# EAGLE schematic CrowPanel ESP32 Display-7.0-inch-V3.0-20240420 (EAGLE 9.6.2)
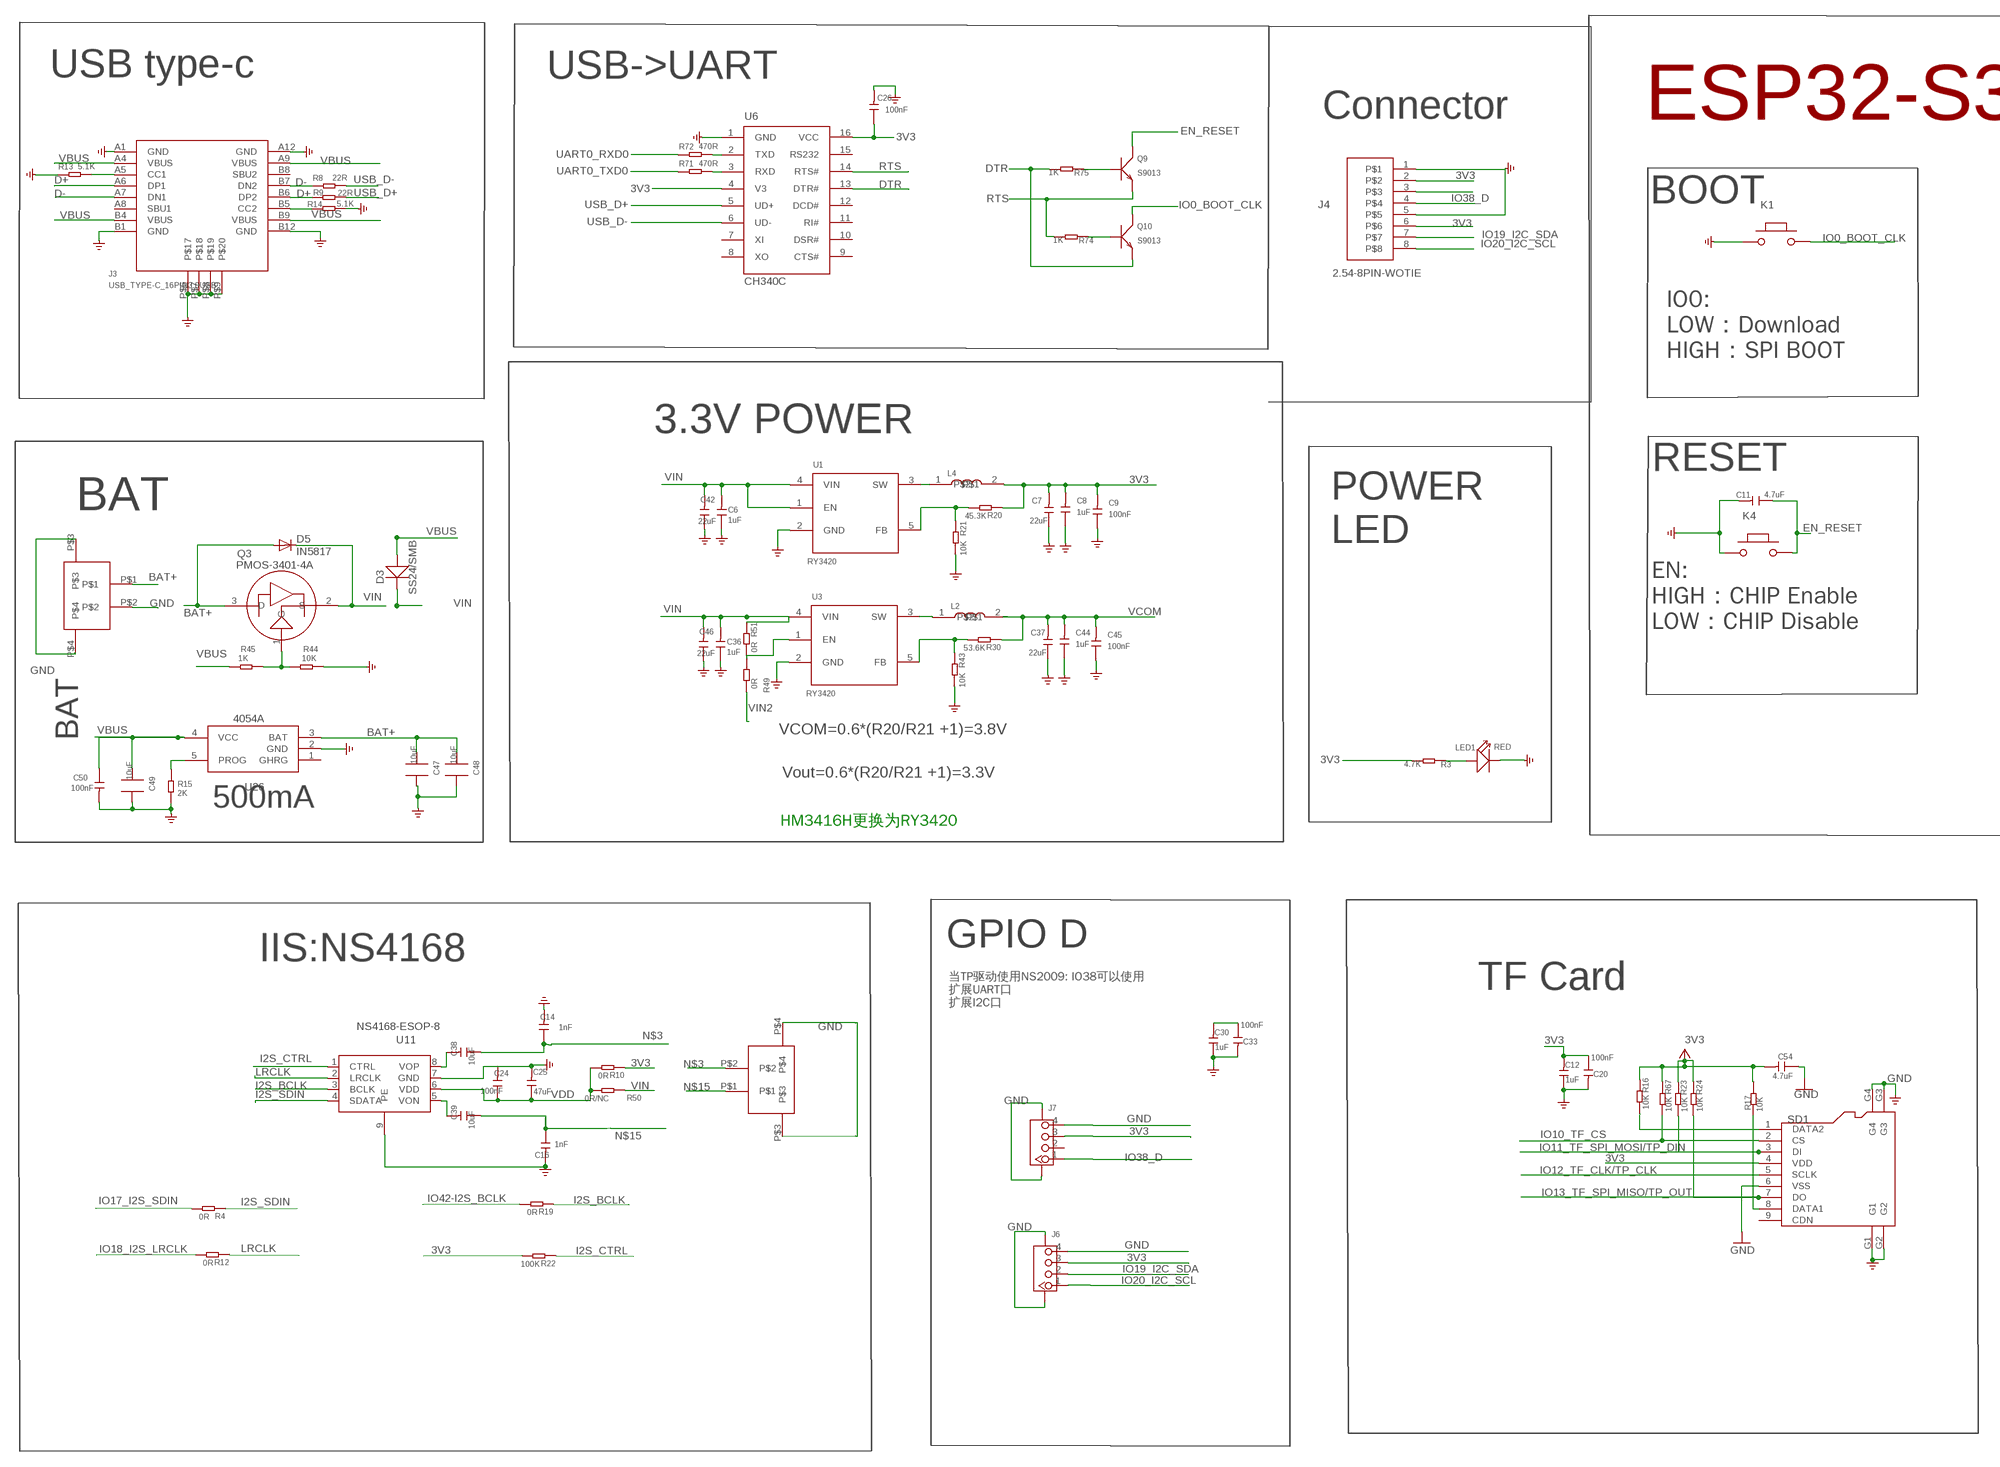
[diagram p0: schematic, sheet 1, part 1 of 2]
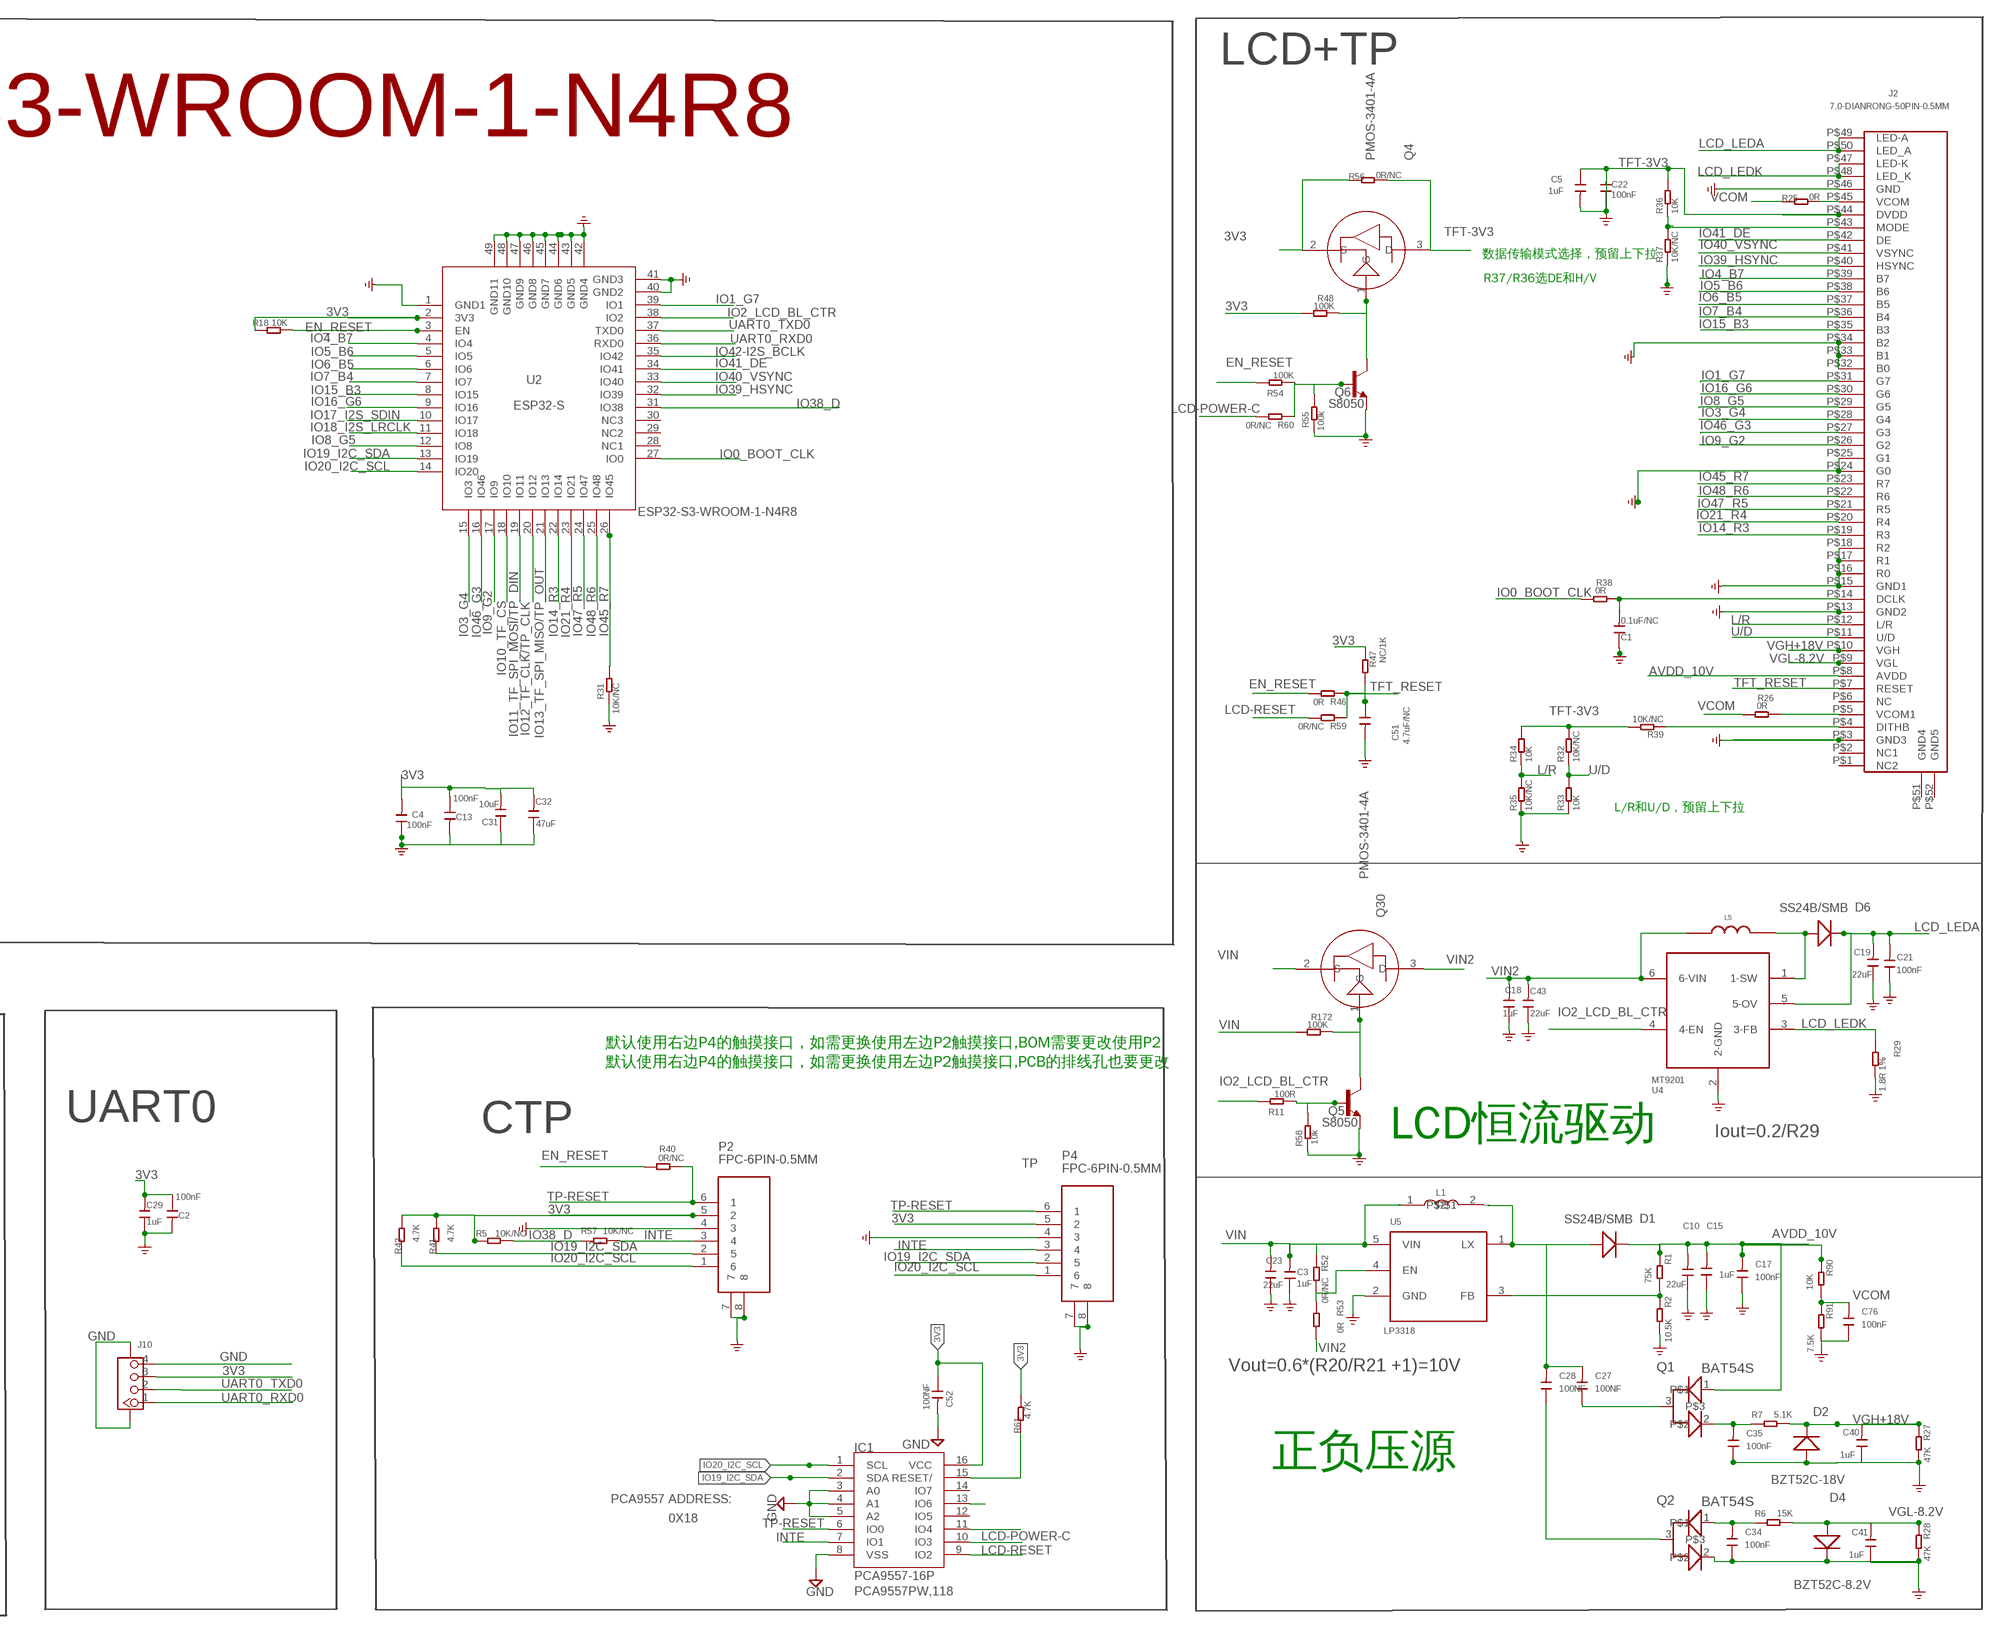
[diagram p1: schematic, sheet 1, part 2 of 2]

## Parts
C1  0.1uF/NC  DISCRETE_C-0603  [DISCRETE_C0603]
C2  100nF  C-0603  [C0603]
C3  1uF  C0603  [0603]
C4  100nF  C-0603  [C0603]
C5  1uF  C-0603  [C0603]
C6  1uF  C0603  [0603]
C7  22uF  C0805  [0805]
C8  1uF  C0603  [0603]
C9  100nF  C0603  [0603]
C10  22uF  C0805  [0805]
C11  4.7uF  C0603  [0603]
C12  1uF  DISCRETE_C-0603  [DISCRETE_C0603]
C13  100nF  C-0603  [C0603]
C14  1nF  C-0603  [C0603]
C15  1uF  C0603  [0603]
C16  1nF  C-0603  [C0603]
C17  100nF  C0603  [0603]
C18  1uF  C0603  [0603]
C19  22uF  C0805  [0805]
C20  100nF  C-0603  [C0603]
C21  100nF  C0603  [0603]
C22  100nF  C-0603  [C0603]
C23  22uF  C0805  [0805]
C24  100nF  C-0603  [C0603]
C25  47uF  C0805  [0805]
C26  100nF  C0603  [0603]
C27  100NF  C0603  [0603]
C28  100NF  C0603  [0603]
C29  1uF  DISCRETE_C-0603  [DISCRETE_C0603]
C30  1uF  DISCRETE_C-0603  [DISCRETE_C0603]
C31  10uF  DISCRETE_C-0603  [DISCRETE_C0603]
C32  47uF  C0805  [0805]
C33  100nF  C-0603  [C0603]
C34  100nF  C0603  [0603]
C35  100nF  C0603  [0603]
C36  1uF  C0603  [0603]
C37  22uF  C0805  [0805]
C38  10uF  C-0603  [C0603]
C39  10uF  C-0603  [C0603]
C40  1uF  C0805  [0805]
C41  1uF  C0805  [0805]
C42  22uF  C0805  [0805]
C43  22uF  C0805  [0805]
C44  1uF  C0603  [0603]
C45  100nF  C0603  [0603]
C46  22uF  C0805  [0805]
C47  10uF  C0805_S  [0805_S]
C48  10uF  C0805_S  [0805_S]
C49  10uF  C0805_S  [0805_S]
C50  100nF  C-0603  [C0603]
C51  4.7uF/NC  C0603  [0603]
C52  100NF  A_XBJ_C0603  [A_XBJ_0603]
C54  4.7uF  DISCRETE_C-0603  [DISCRETE_C0603]
C76  100nF  C0603  [0603]
D1  SS24B/SMB  214ABDO-214AB  [214AB]
D2  BZT52C-18V  DISCRETE_D1206  [DISCRETE_SOD123]
D3  SS24/SMB  214ABDO-214AB  [214AB]
D4  BZT52C-8.2V  DISCRETE_D1206  [DISCRETE_SOD123]
D5  IN5817  DIODE-DO-214AC  [DO-214AC]
D6  SS24B/SMB  214ABDO-214AB  [214AB]
IC1  PCA9557-16P  [TSSOP16]
J1  PH2.0WT-2PIN  [PH2.0WT-2PIN]
J2  7.0-DIANRONG-50PIN-0.5MM  [7.0-DAINRONG-50PIN-0.5MM]
J3  USB_TYPE-C_16PIN3.0USB  [KEVIN_3.0TYPEC-SMD]
J4  2.54-8PIN-WOTIE  [2.54-8P-WOTIE]
J5  PH2.0WT-2PIN  [PH2.0WT-2PIN]
J6  CONNECTOR_TWIG-4P-2.0-SMD-FEMALE-REINFORCE90D  [CONNECTOR_4P-SMD-2.0-90D]
J7  CONNECTOR_TWIG-4P-2.0-SMD-FEMALE-REINFORCE90D  [CONNECTOR_4P-SMD-2.0-90D]
J10  CONNECTOR_TWIG-4P-2.0-SMD-FEMALE-REINFORCE90D  [CONNECTOR_4P-SMD-2.0-90D]
K1  BUTTON  PB157  [157SW]
K4  BUTTON  PB157  [157SW]
L1  L-0530  [CD54_CD54]
L2  L-0530  [CD54_CD54]
L4  L-0530  [CD54_CD54]
L5  CD32_6.8uH  CD32_950MA  [CD32]
LED1  RED  DISCRETE_LED0603  [DISCRETE_LED-0603]
P2  FPC-6PIN-0.5MM  [FPC-6PIN-0.5MM]
P4  FPC-6PIN-0.5MM  [FPC-6PIN-0.5MM]
Q1  BAT54S  [SOT23-3]
Q2  BAT54S  [SOT23-3]
Q3  PMOS-3401-4A  P-MOS-SOT23  [SOT-23]
Q4  PMOS-3401-4A  P-MOS-SOT23  [SOT-23]
Q5  S8050  SPARKFUN_TRANSISTOR_NPNSOT23  [SPARKFUN_SOT23]
Q6  S8050  SPARKFUN_TRANSISTOR_NPNSOT23  [SPARKFUN_SOT23]
Q9  S9013  TRANSISTOR-NPN-SOT23  [SOT23@1]
Q10  S9013  TRANSISTOR-NPN-SOT23  [SOT23@1]
Q30  PMOS-3401-4A  P-MOS-SOT23  [SOT-23]
R1  75K  DISCRETE_R-0603  [DISCRETE_R0603]
R2  10.5K  DISCRETE_R-0603  [DISCRETE_R0603]
R3  4.7K  DISCRETE_R-0603  [DISCRETE_R0603]
R4  0R  DISCRETE_R-0603  [DISCRETE_R0603]
R5  10K/NC  DISCRETE_R-0603  [DISCRETE_R0603]
R6  15K  DISCRETE_R-0603  [DISCRETE_R0603]
R7  5.1K  DISCRETE_R-0603  [DISCRETE_R0603]
R8  22R  DISCRETE_R-0603  [DISCRETE_R0603]
R9  22R  DISCRETE_R-0603  [DISCRETE_R0603]
R10  0R  DISCRETE_R-0603  [DISCRETE_R0603]
R11  100R  R0603  [R0603]
R12  0R  DISCRETE_R-0603  [DISCRETE_R0603]
R13  5.1K  DISCRETE_R-0603  [DISCRETE_R0603]
R14  5.1K  DISCRETE_R-0603  [DISCRETE_R0603]
R15  2K  DISCRETE_R-0603  [DISCRETE_R0603]
R16  10K  DISCRETE_R-0603  [DISCRETE_R0603]
R17  10K  DISCRETE_R-0603  [DISCRETE_R0603]
R18  10K  DISCRETE_R-0603  [DISCRETE_R0603]
R19  0R  DISCRETE_R-0603  [DISCRETE_R0603]
R20  45.3K  DISCRETE_R-0603  [DISCRETE_R0603]
R21  10K  DISCRETE_R-0603  [DISCRETE_R0603]
R22  100K  DISCRETE_R-0603  [DISCRETE_R0603]
R23  10K  DISCRETE_R-0603  [DISCRETE_R0603]
R24  10K  DISCRETE_R-0603  [DISCRETE_R0603]
R25  0R  DISCRETE_R-0603  [DISCRETE_R0603]
R26  0R  R-0603  [R0603]
R27  47K  DISCRETE_R-0603  [DISCRETE_R0603]
R28  47K  DISCRETE_R-0603  [DISCRETE_R0603]
R29  1.8R 1%  DISCRETE_R-0603  [DISCRETE_R0603]
R30  53.6K  DISCRETE_R-0603  [DISCRETE_R0603]
R31  10K/NC  R0603  [R0603]
R32  10K/NC  DISCRETE_R-0603  [DISCRETE_R0603]
R33  10K  DISCRETE_R-0603  [DISCRETE_R0603]
R34  10K  DISCRETE_R-0603  [DISCRETE_R0603]
R35  10K/NC  DISCRETE_R-0603  [DISCRETE_R0603]
R36  10K  DISCRETE_R-0603  [DISCRETE_R0603]
R37  10K/NC  DISCRETE_R-0603  [DISCRETE_R0603]
R38  0R  R-0603  [R0603]
R39  10K/NC  DISCRETE_R-0603  [DISCRETE_R0603]
R40  0R/NC  R-0603  [R0603]
R41  4.7K  DISCRETE_R-0603  [DISCRETE_R0603]
R42  4.7K  DISCRETE_R-0603  [DISCRETE_R0603]
R43  10K  DISCRETE_R-0603  [DISCRETE_R0603]
R44  10K  DISCRETE_R-0603  [DISCRETE_R0603]
R45  1K  DISCRETE_R-0603  [DISCRETE_R0603]
R46  0R  DISCRETE_R-0603  [DISCRETE_R0603]
R47  NC/1K  DISCRETE_R-0603  [DISCRETE_R0603]
R48  100K  R-0603  [R0603]
R49  0R  DISCRETE_R-0603  [DISCRETE_R0603]
R50  0R/NC  DISCRETE_R-0603  [DISCRETE_R0603]
R51  0R  DISCRETE_R-0603  [DISCRETE_R0603]
R52  0R/NC  DISCRETE_R-0603  [DISCRETE_R0603]
R53  0R  DISCRETE_R-0603  [DISCRETE_R0603]
R54  100K  R0603  [R0603]
R55  100k  R0603  [R0603]
R56  0R/NC  DISCRETE_R-0603  [DISCRETE_R0603]
R57  10K/NC  DISCRETE_R-0603  [DISCRETE_R0603]
R58  10k  R0603  [R0603]
R59  0R/NC  DISCRETE_R-0603  [DISCRETE_R0603]
R60  0R/NC  DISCRETE_R-0603  [DISCRETE_R0603]
R61  4.7K  DISCRETE_R-0603  [DISCRETE_R0603]
R67  10K  DISCRETE_R-0603  [DISCRETE_R0603]
R71  470R  DISCRETE_R-0603  [DISCRETE_R0603]
R72  470R  DISCRETE_R-0603  [DISCRETE_R0603]
R74  1K  DISCRETE_R-0603  [DISCRETE_R0603]
R75  1K  DISCRETE_R-0603  [DISCRETE_R0603]
R90  10K  DISCRETE_R-0603  [DISCRETE_R0603]
R91  7.5K  DISCRETE_R-0603  [DISCRETE_R0603]
R172  100K  R-0603  [R0603]
SD1  HOLDER-MICROSD-9P  [9P-SMD-W/-RING]
U1  RY3420  A_XBJ_HM3420B  [A_XBJ_SOT23-5]
U2  ESP32-S  [ESP32-S3]
U3  RY3420  A_XBJ_HM3420B  [A_XBJ_SOT23-5]
U4  MT9201  [SOT23-6]
U5  LP3318  [LP3318_SOT23-5]
U6  CH340C  CH340G  [SOP-16]
U11  NS4168-ESOP-8  [NS4168-ESOP-8]
U26  4054A  [SOP23-5]

## Nets
3V3: C2.1 C4.2 C7.2 C8.2 C9.2 C12.2 C13.1 C20.1 C26.1 C29.2 C30.2 C31.2 C32.2 C33.1 C52.1 C54.2 IC1.16(VCC) J4.2 J4.6 J6.3 J7.3 J10.3 L4.2 P2.5 P4.5 Q4.2(S) R3.2 R5.1 R10.1 R16.1 R17.1 R18.1 R20.1 R22.2 R23.1 R24.1 R41.2 R42.2 R47.2 R48.1 R56.1 R61.2 R67.1 SD1.4(VDD) U2.2(3V3) U6.4(V3) U6.16(VCC) ; supply symbol labelled +3V3
AVDD_10V: C10.2 C15.2 C17.2 D1.2(-) J2.P$8(AVDD) Q1.1 R1.1 R90.1
BAT+: C47.2 C48.2 D5.A J1.P$1 Q3.3(D) U26.3(BAT)
D+: J3.A6(DP1) J3.B6(DP2) R9.1
D-: J3.A7(DN1) J3.B7(DN2) R8.1
DCLK1: C1.2 J2.P$14(DCLK) R38.2
DTR: Q10.2(E) R75.2 U6.13(DTR#)
EN_RESET: C11.1 K4.2 Q9.3(C) R18.2 R40.1 R46.2 R54.2 U2.3(EN)
GND: C1.1 C2.2 C3.1 C4.1 C5.2 C6.1 C7.1 C8.1 C9.1 C10.1 C11.2 C12.1 C13.2 C14.2 C15.1 C16.2 C17.1 C18.1 C19.1 C20.2 C21.1 C22.1 C23.1 C24.2 C25.2 C26.2 C29.1 C30.1 C31.1 C32.1 C33.2 C34.1 C35.1 C36.1 C37.1 C40.1 C41.1 C42.1 C43.1 C44.1 C45.1 C46.1 C47.1 C48.1 C49.1 C50.2 C51.2 C52.2 C54.1 C76.1 D2.+ D4.- IC1.3(A0) IC1.4(A1) IC1.5(A2) IC1.8(VSS) J1.P$2 J1.P$3 J1.P$4 J2.P$3(GND3) J2.P$13(GND2) J2.P$15(GND1) J2.P$16(R0) J2.P$17(R1) J2.P$18(R2) J2.P$24(G0) J2.P$25(G1) J2.P$32(B0) J2.P$33(B1) J2.P$34(B2) J2.P$46(GND) J3.A1(GND) J3.A12(GND) J3.B1(GND) J3.B12(GND) J3.P$6 J3.P$7 J3.P$8 J3.P$9 J4.1 J4.5 J5.P$3 J5.P$4 J6.4 J6.SS1 J6.SS2 J7.4 J7.SS1 J7.SS2 J10.4 J10.SS1 J10.SS2 K1.1 K4.1 LED1.- P2.4 P2.7 P2.8 P4.4 P4.7 P4.8 Q2.2 Q5.2(E) Q6.2(E) R2.2 R13.1 R14.2 R15.2 R21.2 R27.2 R28.2 R29.2 R31.1 R33.1 R35.1 R37.1 R43.2 R44.1 R55.1 R58.1 R91.2 SD1.6(VSS) SD1.G1 SD1.G2 SD1.G3 SD1.G4 U1.2(GND) U2.1(GND1) U2.40(GND2) U2.41(GND3) U2.42(GND4) U2.43(GND5) U2.44(GND6) U2.45(GND7) U2.46(GND8) U2.47(GND9) U2.48(GND10) U2.49(GND11) U3.2(GND) U4.2(2-GND) U5.2(GND) U6.1(GND) U11.7(GND) U11.9(PE) U26.2(GND)
I2S_BCLK: R19.1 U11.3(BCLK)
I2S_CTRL: R22.1 U11.1(CTRL)
I2S_SDIN: R4.1 U11.4(SDATA)
INTE: IC1.7(IO1) P2.3 P4.3 R57.2
IO0_BOOT_CLK: K1.2 Q10.3(C) R38.1 U2.27(IO0)
IO1_G7: J2.P$31(G7) U2.39(IO1)
IO2_LCD_BL_CTR: R11.2 U2.38(IO2) U4.4(4-EN)
IO3_G4: J2.P$28(G4) U2.15(IO3)
IO4_B7: J2.P$39(B7) U2.4(IO4)
IO5_B6: J2.P$38(B6) U2.5(IO5)
IO6_B5: J2.P$37(B5) U2.6(IO6)
IO7_B4: J2.P$36(B4) U2.7(IO7)
IO8_G5: J2.P$29(G5) U2.12(IO8)
IO9_G2: J2.P$26(G2) U2.17(IO9)
IO10_TF_CS: R67.2 SD1.2(CS) U2.18(IO10)
IO11_TF_SPI_MOSI/TP_DIN: R23.2 SD1.3(DI) U2.19(IO11)
IO12_TF_CLK/TP_CLK: SD1.5(SCLK) U2.20(IO12)
IO13_TF_SPI_MISO/TP_OUT: R24.2 SD1.7(DO) U2.21(IO13)
IO14_R3: J2.P$19(R3) U2.22(IO14)
IO15_B3: J2.P$35(B3) U2.8(IO15)
IO16_G6: J2.P$30(G6) U2.9(IO16)
IO17_I2S_SDIN: R4.2 U2.10(IO17)
IO18_I2S_LRCLK: R12.2 U2.11(IO18)
IO19_I2C_SDA: IC1.2(SDA) J4.7 J6.2 P2.2 P4.2 R41.1 U2.13(IO19)
IO20_I2C_SCL: IC1.1(SCL) J4.8 J6.1 P2.1 P4.1 R42.1 U2.14(IO20)
IO21_R4: J2.P$20(R4) U2.23(IO21)
IO38_D: J4.4 J7.1 R5.2 R57.1 U2.31(IO38)
IO39_HSYNC: J2.P$40(HSYNC) U2.32(IO39)
IO40_VSYNC: J2.P$41(VSYNC) U2.33(IO40)
IO41_DE: J2.P$42(DE) U2.34(IO41)
IO42-I2S_BCLK: R19.2 U2.35(IO42)
IO45_R7: J2.P$23(R7) R31.2 U2.26(IO45)
IO46_G3: J2.P$27(G3) U2.16(IO46)
IO47_R5: J2.P$21(R5) U2.24(IO47)
IO48_R6: J2.P$22(R6) U2.25(IO48)
L/R: J2.P$12(L/R) R34.1 R35.2
LCD-POWER-C: IC1.10(IO3) R60.2
LCD-RESET: IC1.9(IO2) R59.2
LCD_LEDA: C19.2 C21.2 D6.2(-) J2.P$49(LED-A) J2.P$50(LED_A) U4.5(5-OV)
LCD_LEDK: J2.P$47(LED-K) J2.P$48(LED_K) R29.1 U4.3(3-FB)
LRCLK: R12.1 U11.2(LRCLK)
N$1: LED1.+ R3.1
N$2: J2.P$45(VCOM) R25.2
N$3: C14.1 C38.1 J5.P$2
N$4: J2.P$5(VCOM1) R26.2
N$6: C38.2 U11.8(VOP)
N$7: R1.2 R2.1 U5.3(FB)
N$8: C39.2 U11.5(VON)
N$9: C27.2 C28.2 D1.1(+) L1.2 U5.1(LX)
N$10: C27.1 Q1.3
N$11: J3.A5(CC1) R13.2
N$12: J2.P$43(MODE) R36.1 R37.2
N$13: L4.1 U1.3(SW)
N$14: J2.P$4(DITHB) R39.1
N$15: C16.1 C39.1 J5.P$1
N$16: D6.1(+) L5.2 U4.1(1-SW)
N$17: J3.B5(CC2) R14.1
N$18: R30.2 R43.1 U3.5(FB)
N$19: L2.1 U3.3(SW)
N$20: R20.2 R21.1 U1.5(FB)
N$21: Q3.1(G) R44.2 R45.1
N$22: R15.1 U26.5(PROG)
N$23: Q5.1(B) R11.1 R58.2
N$24: C28.1 Q2.3
N$26: R49.1 R51.2 U3.1(EN)
N$27: Q4.1(G) Q6.3(C) R48.2
N$28: J4.3
N$29: C35.2 Q1.2 R7.1
N$30: C34.2 Q2.1 R6.1
N$31: R52.2 R53.1 U5.4(EN)
N$32: Q9.1(B) R75.1
N$33: Q6.1(B) R54.1 R55.2 R60.1
N$36: Q5.3(C) Q30.1(G) R172.2
N$38: Q10.1(B) R74.1
N$40: R72.2 U6.2(TXD)
N$41: IC1.13(IO6)
N$42: R71.2 U6.3(RXD)
N$43: IC1.11(IO4)
N$47: R16.2 SD1.1(DATA2)
N$48: R17.2 SD1.8(DATA1)
N$66: IC1.15(RESET/) R61.1
RTS: Q9.2(E) R74.2 U6.14(RTS#)
TFT-3V3: C5.1 C22.2 J2.P$44(DVDD) Q4.3(D) R32.2 R34.2 R36.2 R39.2 R56.2
TFT_RESET: C51.1 J2.P$7(RESET) R46.1 R47.1 R59.1
TP-RESET: IC1.6(IO0) P2.6 P4.6 R40.2
U/D: J2.P$11(U/D) R32.1 R33.2
UART0_RXD0: J10.1 R72.1 U2.36(RXD0)
UART0_TXD0: J10.2 R71.1 U2.37(TXD0)
USB_D+: R9.2 U6.5(UD+)
USB_D-: R8.2 U6.6(UD-)
VBUS: C49.2 C50.1 D3.1(+) J3.A4(VBUS) J3.A9(VBUS) J3.B4(VBUS) J3.B9(VBUS) R45.2 U26.4(VCC)
VCOM: C37.2 C44.2 C45.2 C76.2 L2.2 R25.1 R26.1 R30.1 R90.2 R91.1
VDD: C24.1 C25.1 R10.2 R50.2 U11.6(VDD)
VGH+18V: C40.2 D2.- J2.P$10(VGH) R7.2 R27.1
VGL-8.2V: C41.2 D4.+ J2.P$9(VGL) R6.2 R28.1
VIN: C3.2 C6.2 C23.2 C36.2 C42.2 C46.2 D3.2(-) D5.C L1.1 Q3.2(S) Q30.2(S) R50.1 R51.1 R52.1 R172.1 U1.1(EN) U1.4(VIN) U3.4(VIN) U5.5(VIN)
VIN2: C18.2 C43.2 L5.1 Q30.3(D) R49.2 R53.2 U4.6(6-VIN)
Unconnected: IC1.12(IO5) IC1.14(IO7) J2.P$1(NC2) J2.P$2(NC1) J2.P$6(NC) J2.P$51(GND4) J2.P$52(GND5) J3.A8(SBU1) J3.B8(SBU2) J7.2 SD1.9(CDN) U2.28(NC1) U2.29(NC2) U2.30(NC3) U6.7(XI) U6.8(XO) U6.9(CTS#) U6.10(DSR#) U6.11(RI#) U6.12(DCD#) U6.15(RS232) U26.1(GHRG)

## Notes on the sheet
- LCD+TP
- USB type-c | USB->UART
- Connector | ESP32-S3-WROOM-1-N4R8
- BOOT
- 数据传输模式选择，预留上下拉
- R37/R36选DE和H/V
- IO0:
  LOW：Download
  HIGH：SPI BOOT
- 3.3V POWER
- RESET
- BAT
- POWER
  LED
- EN:
  HIGH：CHIP Enable
  LOW：CHIP Disable
- L/R和U/D，预留上下拉
- VCOM=0.6*(R20/R21 +1)=3.8V
- BAT
- Vout=0.6*(R20/R21 +1)=3.3V
- 500mA
- HM3416H更换为RY3420
- 默认使用右边P4的触摸接口，如需更换使用左边P2触摸接口,BOM需要更改使用P2
- GPIO D | 默认使用右边P4的触摸接口，如需更换使用左边P2触摸接口,PCB的排线孔也要更改
- IIS:NS4168
- TF Card | UART0
- CTP
- 当TP驱动使用NS2009: IO38可以使用
  扩展UART口
  扩展I2C口
- LCD恒流驱动 | Iout=0.2/R29
- TP
- Vout=0.6*(R20/R21 +1)=10V
- 正负压源
- PCA9557 ADDRESS:
- 0X18
- PCA9557PW,118

## Library data of the parts
C1 C31 C54 = A9G:DISCRETE_C*: Ceramic Capacitors
C2 C4 C5 C13 C14 C16 C20 C22 C24 C33 C38 C39 C50 = discrete:C*: Ceramic Capacitors
C3 C6 C8 C9 C11 C15 C17 C18 C21 C26-C28 C34-C36 C44 C45 C51 C76 = A_xbj:C0603
C7 C10 C19 C23 C25 C32 C37 C40-C43 C46 = A_xbj:C0805
C12 C29 C30 = A_xbj:DISCRETE_C*: Ceramic Capacitors
C47-C49 = CPT_SMD:C0805
C52 = CrowBot_V1.4:A_XBJ_C0603
D1 D3 D6 = DO-214AB:214AB: 214AB
D2 D4 = cooper:DISCRETE_D*
D5 = diode:DIODE-: DIODE
IC1 = Lora_RA-08H_Dev:PCA9557-16P
J1 J5 = cooper:PH2.0WT-2PIN
J2 = cooper:7.0-DIANRONG-50PIN-0.5MM
J3 = WZ3532R024-ESP32-V0.1-20221226:USB_TYPE-C_16PIN
J4 = cooper:2.54-8PIN-WOTIE
J6 J7 J10 = A_xbj:CONNECTOR_TWIG-4P-2.0-SMD-FEMALE-REINFORCE
K1 K4 = MySMD:PB157
L1 L2 L4 = WZ2432R028-ESP32-V1.2-20231108:L-0530
L5 = CD54:CD32_950MA
LED1 = A_xbj:DISCRETE_LED*
P2 P4 = cooper:FPC-6PIN-0.5MM
Q1 Q2 = cooper:BAT54S
Q3 Q4 Q30 = DFN8:P-MOS-SOT23
Q5 Q6 = Adafruit_HUZZAH32_ESP32_Feather:SPARKFUN_TRANSISTOR_NPN: Transistor NPN BJT configuration in SOT23 package. MMBT2222 is the common NPN we use. Double check BCE configuration again layout.
Q9 Q10 = discrete:TRANSISTOR-NPN*: NPN audion
R1-R10 R12-R14 R16-R25 R27-R30 R41-R43 R46 R47 R49-R53 R56 R57 R59 R60 R67 R71 R72 R74 R75 R90 R91 = Crowtail-_LED-V2.0-20190615-01:DISCRETE_R*
R11 R31 R54 R55 R58 = cooper:R0603
R15 R32-R37 R39 R44 R45 = A9G:DISCRETE_R*
R26 R38 R40 R48 R172 = discrete:R*
R61 = Lora_RA-08H_Dev:DISCRETE_R*
SD1 = Connector:HOLDER-MICROSD-9P
U1 U3 = CrowBot_-V1.0-20220525:A_XBJ_HM3420B
U2 = DW1000:ESP32-S; U2: ESP32-S3-WROOM-1-N4R8
U4 = cooper:MT9201
U5 = cooper:LP3318
U6 = A_xbj:CH340G
U11 = STC_MCUSTC8G1K08A:NS4168-ESOP-8
U26 = DFN8:4054A

## Net classes
0 default: width 0.152 mm, drill 0.305 mm, clearance 0.203 mm
2 GND: width 0.203 mm